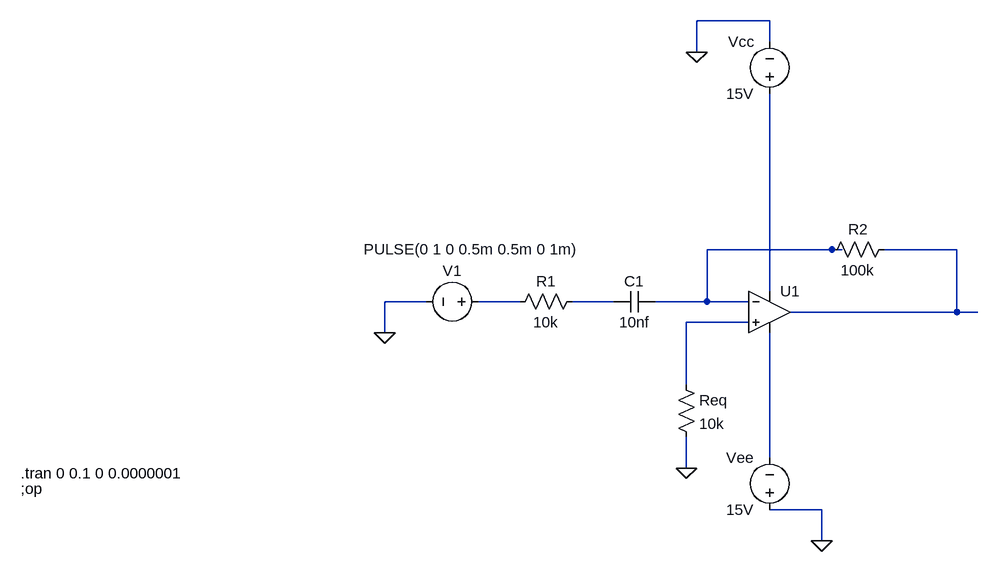
[diagram p0: schematic derivative opamp circuit.asc]
derivative opamp circuit.asc, the LTspice schematic file:
Version 4
SHEET 1 880 680
WIRE 224 -272 112 -272
WIRE 224 -240 224 -272
WIRE 112 -224 112 -272
WIRE 320 80 128 80
WIRE 336 80 320 80
WIRE 512 80 400 80
WIRE 224 144 224 -160
WIRE -304 160 -368 160
WIRE -160 160 -224 160
WIRE -16 160 -80 160
WIRE 128 160 128 80
WIRE 128 160 48 160
WIRE 192 160 128 160
WIRE 512 176 512 80
WIRE 512 176 256 176
WIRE 544 176 512 176
WIRE 192 192 96 192
WIRE -368 208 -368 160
WIRE 96 288 96 192
WIRE 224 400 224 208
WIRE 96 416 96 368
WIRE 304 480 224 480
WIRE 304 528 304 480
FLAG 112 -224 0
FLAG 304 528 0
FLAG 96 416 0
FLAG -368 208 0
SYMBOL Opamps\\UniversalOpamp2 224 176 R0
SYMATTR InstName U1
SYMBOL voltage 224 -144 R180
WINDOW 0 24 96 Left 2
WINDOW 3 24 16 Left 2
WINDOW 123 0 0 Left 0
WINDOW 39 0 0 Left 0
SYMATTR InstName Vcc
SYMATTR Value 15V
SYMBOL voltage 224 496 R180
WINDOW 0 24 96 Left 2
WINDOW 3 24 16 Left 2
WINDOW 123 0 0 Left 0
WINDOW 39 0 0 Left 0
SYMATTR InstName Vee
SYMATTR Value 15V
SYMBOL res 416 64 R90
WINDOW 0 0 56 VBottom 2
WINDOW 3 32 56 VTop 2
SYMATTR InstName R2
SYMATTR Value 100k
SYMBOL cap 48 144 R90
WINDOW 0 0 32 VBottom 2
WINDOW 3 32 32 VTop 2
SYMATTR InstName C1
SYMATTR Value 10nf
SYMBOL res -64 144 R90
WINDOW 0 0 56 VBottom 2
WINDOW 3 32 56 VTop 2
SYMATTR InstName R1
SYMATTR Value 10k
SYMBOL res 80 272 R0
SYMATTR InstName Req
SYMATTR Value 10k
SYMBOL voltage -208 160 R90
WINDOW 0 -32 56 VBottom 2
WINDOW 3 -96 27 VTop 2
WINDOW 123 0 0 Left 0
WINDOW 39 0 0 Left 0
SYMATTR InstName V1
SYMATTR Value PULSE(0 1 0 0.5m 0.5m 0 1m)
TEXT -928 448 Left 2 !;op
TEXT -928 424 Left 2 !.tran 0 0.1 0 0.0000001

The netlist it stands for:
* derivative opamp circuit.asc
XU1 N006 N001 N003 N007 N002 level.2 Avol=1Meg GBW=10Meg Slew=10Meg ilimit=25m rail=0 Vos=0 phimargin=45 en=0 enk=0 in=0 ink=0 Rin=500Meg  ; pins IN+ IN- V+ V- OUT
Vcc N003 0 15V
Vee 0 N007 15V
R2 N002 N001 100k
C1 N001 N005 10nf
R1 N005 N004 10k
Req N006 0 10k
V1 N004 0 PULSE(0 1 0 0.5m 0.5m 0 1m)
;op
.tran 0 0.1 0 0.0000001
.lib UniversalOpamps2.sub
.backanno
.end